# EAGLE schematic test 2 v3 (EAGLE 9.7.0)
SIM_ABSTOL: 1e-12; SIM_AC_SWEEP_TYPE: Lin; SIM_CHGTOL: 1e-15; SIM_DC_END: 10000; SIM_DC_SOURCE: BT1; SIM_DC_START: 1; SIM_GMIN: 1e-12; SIM_ITL1: 100; SIM_ITL2: 50; SIM_ITL4: 10; SIM_MAX_LIMIT: 2000; SIM_METHOD: TRAP; SIM_NUMPOINTS: 500; SIM_PIVREL: 1e-3; SIM_PIVTOL: 1e-13; SIM_RELTOL: 1e-3; SIM_RSHUNT: OFF; SIM_SRCSTEPS: 0; SIM_TEMPERATURE: 25.0; SIM_THEME: light; SIM_TRAN_AC_END: 10000; SIM_TRAN_AC_START: 1; SIM_TRAN_END: 10 ms; SIM_TRAN_START: 0; SIM_TRTOL: 7; SIM_TYPE: Transient; SIM_VNTOL: 1e-6
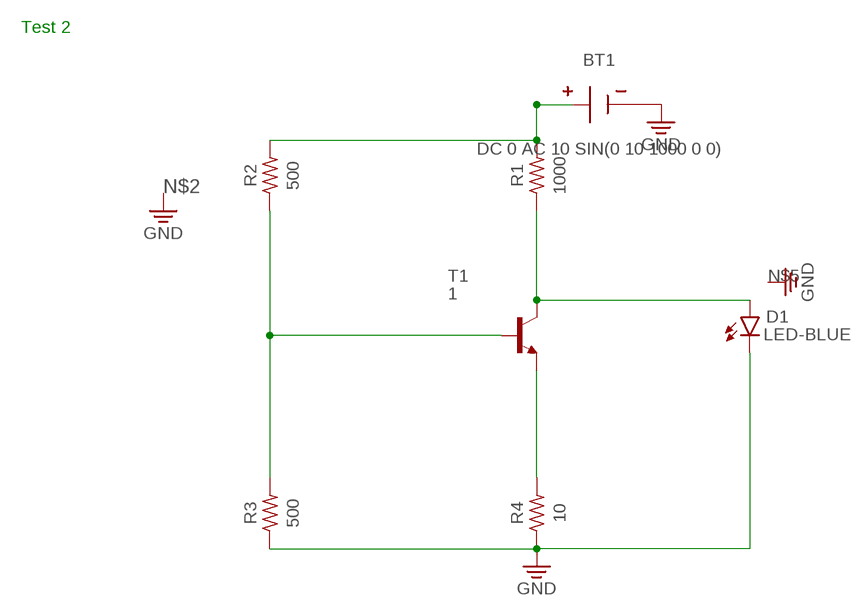
[diagram p0: schematic, sheet 1]

## Parts
BT1  DC 0 AC 10 SIN(0 10 1000 0 0)  COIN-CELL-SMT-3P-3012-BR1616  [BAT_3012]
D1  LED-BLUE  LED_RADIALBLUE  [LEDRD254W60D565H860B_B]
R1  1000  R-US_AXIAL-7.2MM-PITCH  [RESAD724W46L381D178B]
R2  500  R-US_AXIAL-7.2MM-PITCH  [RESAD724W46L381D178B]
R3  500  R-US_AXIAL-7.2MM-PITCH  [RESAD724W46L381D178B]
R4  10  R-US_AXIAL-7.2MM-PITCH  [RESAD724W46L381D178B]
T1  1  BC368-NPN-TO92-ECB  [TO92-ECB]

## Nets
GND: BT1.N(-) D1.C R3.1 R4.1
N$1: BT1.P1(+) BT1.P(+) R1.2 R2.2
N$2: R2.1 R3.2 T1.B
N$4: R4.2 T1.E
N$5: D1.A R1.1 T1.C

## Notes on the sheet
- Test 2

## Library data of the parts
BT1 = Tinkercad:COIN-CELL-SMT-3P-?-: Battery Holders - Coin Cell SMD - CR2032, LR44, SR44 etc. Datasheet <https://docs.rs-online.com/b397/0900766b813ec0e2.pdf>; CATEGORY: Battery-Holder; CELL_DIAMETER: 16mm; DESCRIPTION: Battery Retainer Coin, 16.0mm 1 Cell SMD (SMT) Tab; MANUFACTURER: Keystone Electronics; MPN: 3012; PART_STATUS: ACTIVE; ROHS_COMPLIANT: COMPLIANT; SERIES: -; SPICEPREFIX: V; SUB-CATEGORY: Holder; TYPE: Coin Cell; VALUE: BR1616
D1 = Opto-Electronic:LED_RADIAL: LED - Generic; SPICEMODEL: DMOD; SPICEMODELTEXT: ********************** \n* Autodesk EAGLE - Spice Model File \n* Date: 9/17/17 \n* basic diode intrinsic model \n********************** \n.MODEL DMOD D; SPICEPREFIX: D
R1-R3 = Resistor:R-US: Resistor Fixed - ANSI; CATEGORY: Resistor; SPICEPREFIX: R; SUB-CATEGORY: Fixed
R4 = Resistor:R-US: Resistor Fixed - ANSI; CATEGORY: Resistor; SUB-CATEGORY: Fixed
T1 = transistor-neu-to92:*-NPN-: NPN Transistror; SPICEMODEL: QNPN; SPICEMODELTEXT: ********************** \n* Autodesk EAGLE - Spice Model File \n* Date: 9/17/17 \n* basic npn intrinsic model \n********************** \n.MODEL QNPN NPN; SPICEPREFIX: Q